# Altium schematic sheet 5.RK3588_OSC_PLL_PMUIO1.SchDoc
size A4; SheetNumber: 5; SheetTotal: 21
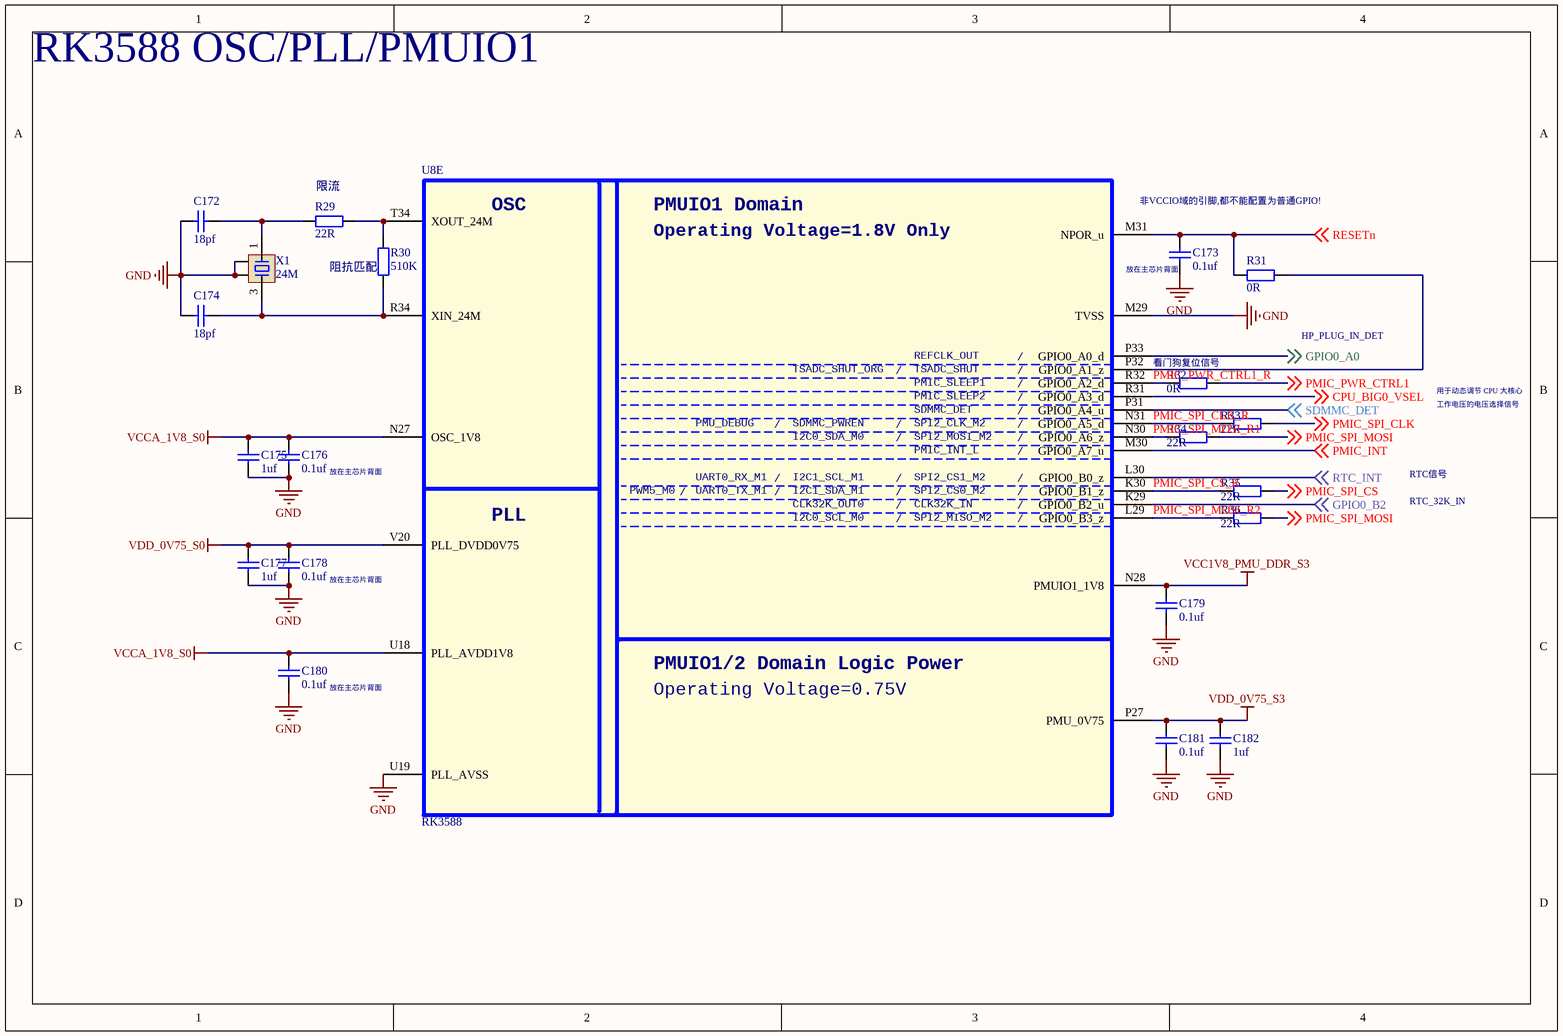
[diagram p0: 5.RK3588_OSC_PLL_PMUIO1.SchDoc]

## Parts
C172  18pf  [C0402_L]
C173  0.1uf  [C0201_L]
C174  18pf  [C0402_L]
C175  1uf  [C0201_L]
C176  0.1uf  [C0201_L]
C177  1uf  [C0201_L]
C178  0.1uf  [C0201_L]
C179  0.1uf  [C0201_L]
C180  0.1uf  [C0201_L]
C181  0.1uf  [C0201_L]
C182  1uf  [C0201_L]
R29  22R  [R0402_L]
R30  510K  [R0402_L]
R31  0R  [R0201_L]
R32  0R  [R0201_L]
R33  22R  [R0201_L]
R34  22R  [R0201_L]
R35  22R  [R0201_L]
R36  22R  [R0201_L]
U8  RK3588  [BGA1088_23R00X23R00X2R00]  (part E of 26)
X1  24M  [XTAL-3225-4P]

## Nets
GND: C172.1 C173.1 C174.1 C175.1 C176.1 C177.1 C178.1 C179.1 C180.1 C181.1 C182.1 U8.M29(TVSS) U8.U19(PLL_AVSS) X1.2 X1.4
VCC1V8_PMU_DDR_S3: C179.2 U8.N28(PMUIO1_1V8)
VCCA_1V8_S0: C175.2 C176.2 C180.2 U8.N27(OSC_1V8) U8.U18(PLL_AVDD1V8)
VDD_0V75_S0: C177.2 C178.2 U8.V20(PLL_DVDD0V75)
VDD_0V75_S3: C181.2 C182.2 U8.P27(PMU_0V75)
CPU_BIG0_VSEL: U8.R31(GPIO0_A3_d) ; off-sheet CPU_BIG0_VSEL
GPIO0_A0: U8.P33(GPIO0_A0_d) ; off-sheet GPIO0_A0
GPIO0_B2: U8.K29(GPIO0_B2_u) ; off-sheet GPIO0_B2
PMIC_INT: U8.M30(GPIO0_A7_u) ; off-sheet PMIC_INT
PMIC_PWR_CTRL1: R32.2 ; off-sheet PMIC_PWR_CTRL1
PMIC_PWR_CTRL1_R: R32.1 U8.R32(GPIO0_A2_d)
PMIC_SPI_CLK: R33.2 ; off-sheet PMIC_SPI_CLK
PMIC_SPI_CLK_R: R33.1 U8.N31(GPIO0_A5_d)
PMIC_SPI_CS: R35.2 ; off-sheet PMIC_SPI_CS
PMIC_SPI_CS_R: R35.1 U8.K30(GPIO0_B1_z)
PMIC_SPI_MOSI: R34.2 R36.2 ; off-sheet PMIC_SPI_MOSI
PMIC_SPI_MOSI_R1: R34.1 U8.N30(GPIO0_A6_z)
PMIC_SPI_MOSI_R2: R36.1 U8.L29(GPIO0_B3_z)
RESETn: C173.2 R31.1 U8.M31(NPOR_u) ; off-sheet RESETn
RTC_INT: U8.L30(GPIO0_B0_z) ; off-sheet RTC_INT
SDMMC_DET: U8.P31(GPIO0_A4_u) ; off-sheet SDMMC_DET
NetC172_2: C172.2 R29.2 X1.1
NetC174_2: C174.2 R30.1 U8.R34(XIN_24M) X1.3
NetR29_1: R29.1 R30.2 U8.T34(XOUT_24M)
NetR31_2: R31.2 U8.P32(GPIO0_A1_z)

## Notes on the sheet
- RK3588 OSC/PLL/PMUIO1
- (near R29) 限流
- 非VCCIO域的引脚,都不能配置为普通GPIO!
- 阻抗匹配
- (near U8) 放在主芯片背面
- (near R32) 看门狗复位信号
- HP_PLUG_IN_DET
- 用于动态调节 CPU 大核心
- 工作电压的电压选择信号
- (near C176) 放在主芯片背面
- RTC信号
- RTC_32K_IN
- (near C178) 放在主芯片背面
- (near C180) 放在主芯片背面
- (in symbol SOC_RK3588, part E) OSC; PMUIO1 Domain; Operating Voltage=1.8V Only; REFCLK_OUT; /; TSADC_SHUT_ORG; TSADC_SHUT; PMIC_SLEEP1; PMIC_SLEEP2; SDMMC_DET; PMU_DEBUG; SDMMC_PWREN; SPI2_CLK_M2; I2C0_SDA_M0; SPI2_MOSI_M2; PMIC_INT_L; UART0_RX_M1; I2C1_SCL_M1; SPI2_CS1_M2; PWM5_M0; UART0_TX_M1; I2C1_SDA_M1; SPI2_CS0_M2; CLK32K_OUT0; CLK32K_IN; PLL; I2C0_SCL_M0; SPI2_MISO_M2; PMUIO1/2 Domain Logic Power; Operating Voltage=0.75V

## Library data of the parts
C172-C182 = C: 贴片电容/MLCC电容
R29-R36 = R: 贴片电阻
U8 = SOC_RK3588: ROCKCHIP SOC
X1 = XTAL-4P: 4脚无源晶振(谐振器）